# Altium schematic sheet Microcontroller.SchDoc
size 270 x 162 mm; SheetNumber: 1; SheetTotal: 1
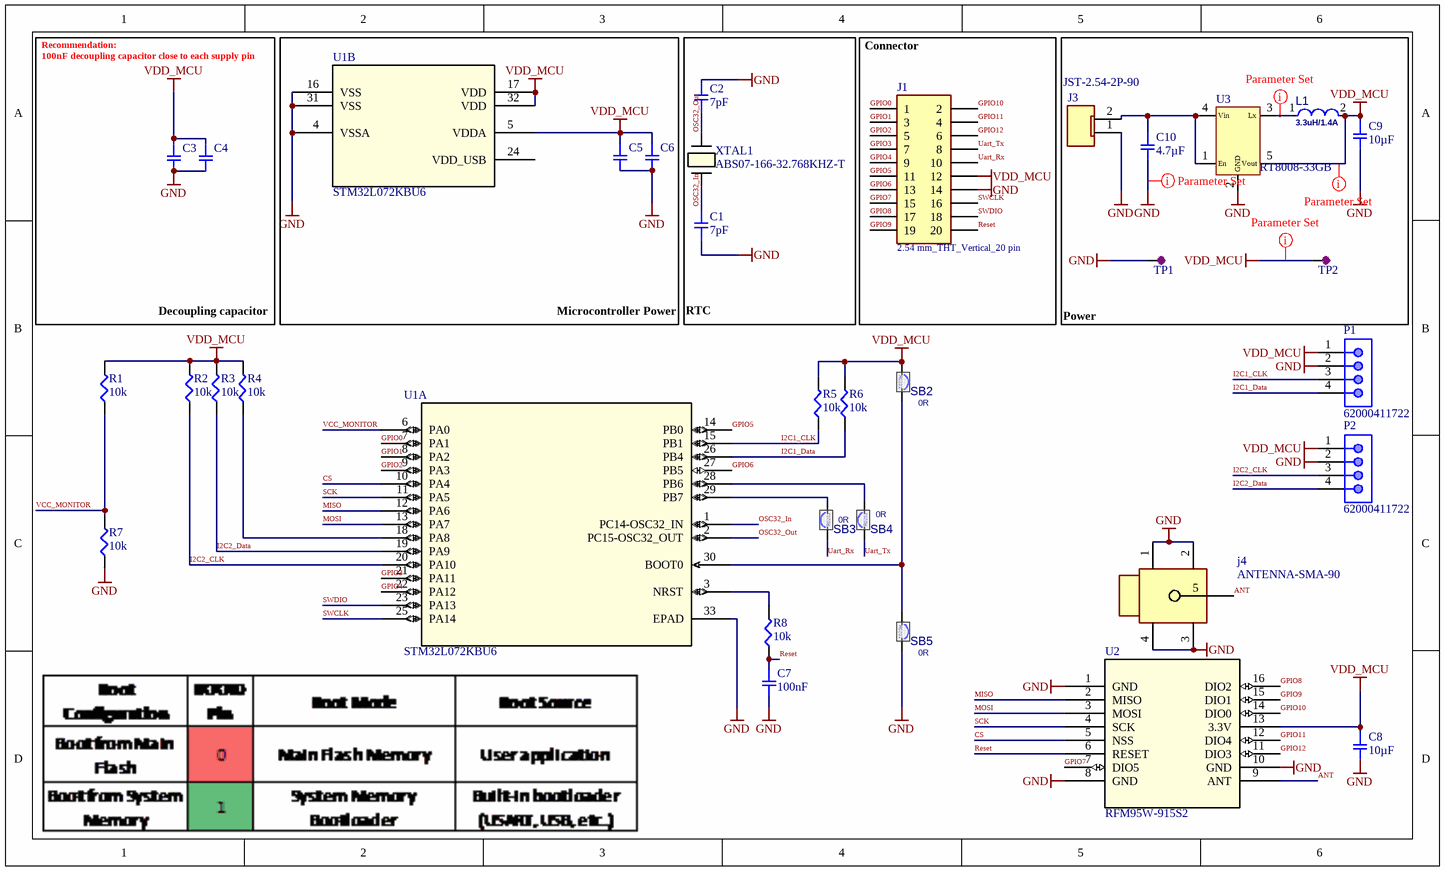
[diagram p0: Microcontroller.SchDoc]

## Parts
C1  7pF  [SMD-0402C]
C2  7pF  [SMD-0402C]
C3  100nF  [Cap0201]  (value not drawn)
C4  100nF  [Cap0201]  (value not drawn)
C5  100nF  [Cap0201]  (value not drawn)
C6  1µF  [Cap0201]  (value not drawn)
C7  100nF  [Cap0201]
C8  10µF  [SMD-0805C]
C9  10µF  [SMD-0805C]
C10  4.7µF  [SMD-0805C]
J1  2.54 mm_THT_Vertical_20 pin  [61302021121]
J3  JST-2.54-2P-90  [JST-2.54-2P-90]
j4  ANTENNA-SMA-90  [ANTENNA-SMA-90]
L1  3.3uH/1.4A  [INDP2520x12N]
P1  62000411722  [62000411722]
P2  62000411722  [62000411722]
R1  10k  [Res0201]
R2  10k  [Res0201]
R3  10k  [Res0201]
R4  10k  [Res0201]
R5  10k  [Res0201]
R6  10k  [Res0201]
R7  10k  [Res0201]
R8  10k  [Res0201]
SB2  0R  [Res0201]
SB3  0R  [Res0201]
SB4  0R  [Res0201]
SB5  0R  [Res0201]
TP1  TPSMD_25mil  [TPSMD_25mil]  (value not drawn)
TP2  TPSMD_25mil  [TPSMD_25mil]  (value not drawn)
U1  STM32L072KBU6  [UFQFPN32-5x5mm-L]  (parts A,B of 2)
U2  RFM95W-915S2  [IC16_RFM95W-915S2_RFS]
U3  RT8008-33GB  [SOT23, 5]
XTAL1  ABS07-166-32.768KHZ-T  [XTAL_ABS07-166-32.768KHZ-T_ABR]

## Blocks framed on the sheet
Decoupling capacitor: C3 C4
Microcontroller Power: C5 C6 U1
RTC: C1 C2 XTAL1
Connector: J1
Power: C9 C10 J3 L1 TP1 TP2 U3

## Nets
GND: C1.1 C2.2 C3.2 C4.2 C5.2 C6.2 C7.2 C8.2 C9.2 C10.2 J1.14 J3.1 j4.1 j4.2 j4.3 j4.4 P1.2 P2.2 R7.1 SB5.1 TP1.1 U1.4(VSSA) U1.16(VSS) U1.31(VSS) U1.33(EPAD) U2.1(GND) U2.8(GND) U2.10(GND) U3.2(GND)
VDD_MCU: C3.1 C4.1 C5.1 C6.1 C8.1 C9.1 J1.12 L1.2 P1.1 P2.1 R1.2 R2.2 R3.2 R4.2 R5.2 R6.2 SB2.2 TP2.1 U1.5(VDDA) U1.17(VDD) U1.32(VDD) U2.13(3.3V) U3.5(Vout)
ANT: j4.5 U2.9(ANT)
CS: U1.10(PA4) U2.5(NSS)
GPIO0: J1.1 U1.7(PA1)
GPIO1: J1.3 U1.8(PA2)
GPIO2: J1.5 U1.9(PA3)
GPIO3: J1.7 U1.21(PA11)
GPIO4: J1.9 U1.22(PA12)
GPIO5: J1.11 U1.14(PB0)
GPIO6: J1.13 U1.27(PB5)
GPIO7: J1.15 U2.7(DIO5)
GPIO8: J1.17 U2.16(DIO2)
GPIO9: J1.19 U2.15(DIO1)
GPIO10: J1.2 U2.14(DIO0)
GPIO11: J1.4 U2.12(DIO4)
GPIO12: J1.6 U2.11(DIO3)
I2C1_CLK: P1.3 R5.1 U1.15(PB1)
I2C1_Data: P1.4 R6.1 U1.26(PB4)
I2C2_CLK: P2.3 R2.1 U1.20(PA10)
I2C2_Data: P2.4 R3.1 U1.19(PA9)
MISO: U1.12(PA6) U2.2(MISO)
MOSI: U1.13(PA7) U2.3(MOSI)
OSC32_In: C1.2 U1.1(PC14-OSC32_IN) XTAL1.2
OSC32_Out: C2.1 U1.2(PC15-OSC32_OUT) XTAL1.1
Reset: C7.1 J1.20 R8.1 U2.6(RESET)
SCK: U1.11(PA5) U2.4(SCK)
SWCLK: J1.16 U1.25(PA14)
SWDIO: J1.18 U1.23(PA13)
Uart_Rx: J1.10 SB3.2
Uart_Tx: J1.8 SB4.2
VCC_MONITOR: R1.1 R7.2 U1.6(PA0)
NetC10_1: C10.1 J3.2 U3.1(En) U3.4(Vin)
NetL1_1: L1.1 U3.3(Lx)
NetR4_1: R4.1 U1.18(PA8)
NetR8_2: R8.2 U1.3(NRST)
NetSB2_1: SB2.1 SB5.2 U1.30(BOOT0)
NetSB3_1: SB3.1 U1.29(PB7)
NetSB4_1: SB4.1 U1.28(PB6)

Not connected (* = marked no-connect by the designer): U1 24(VDD_USB)

## Layout directives
rule Width Constraint [Pref Width = 0.3mm    Min Width = 0.254mm    Max Width = 0.4mm]: (no net found under the mark), GND, VDD_MCU

## Notes on the sheet
- Recommendation:
  100nF decoupling capacitor close to each supply pin
- (in symbol RC0201JR-070RL) R0201

## Library data of the parts
C1 C2 = GJM1555C1H7R0DB01D: CAP CER 7PF 50V NP0 0402; Manufacturer: Murata Electronics North America; Factory Stock: 0; Unit Price (USD): 0.12; Minimum Quantity: 1; Tolerance: ±0.5pF; Temperature Coefficient: C0G, NP0; Datasheets: http://www.murata.com/~/media/webrenewal/support/library/catalog/products/capacitor/mlcc/c02e.pdf; Image: //media.digikey.com/Renders/Murata%20Renders/ZRB-SERIES-0402.jpg; Digi-Key Part Number: 490-13315-1-ND; Part Number: GJM1555C1H7R0DB01D; Quantity Available: 9210; @ qty: 0; Packaging: Cut Tape (CT); Series: GJM; Part Status: Active; Value: 7pF; Voltage: 50V; Operating Temperature: -55°C ~ 125°C; Features: High Q, Low Loss; Ratings: -; Applications: RF, Microwave, High Frequency; Mounting Type: Surface Mount, MLCC; Package / Case: 0402 (1005 Metric); Size / Dimension: 0.039" L x 0.020" W (1.00mm x 0.50mm); Height - Seated (Max): -; Thickness (Max): 0.022" (0.55mm); Lead Spacing: -; Lead Style: -
C3-C5 C7 = GRM033R61A104ME15D: CAP CER 0.1UF 10V X5R 0201; Manufacturer: Murata Electronics North America; Factory Stock: 0; Unit Price (USD): 0.1; Minimum Quantity: 1; Tolerance: ±20%; Datasheets: http://www.murata.com/~/media/webrenewal/support/library/catalog/products/capacitor/mlcc/c02e.pdf; Image: //media.digikey.com/Renders/Murata%20Renders/ZRB-SERIES-0402.jpg; Digi-Key Part Number: 490-5405-1-ND; Part Number: GRM033R61A104ME15D; Quantity Available: 295564; @ qty: 0; Packaging: Cut Tape (CT); Series: GRM; Part Status: Active; Value: 100nF; Voltage: 10V; Temperature Coefficient: X5R; Operating Temperature: -55°C ~ 85°C; Features: -; Ratings: -; Applications: General Purpose; Failure Rate: Surface Mount, MLCC; Mounting Type: 0201 (0603 Metric); Package / Case: 0.024" L x 0.012" W (0.60mm x 0.30mm); Size / Dimension: -; Height - Seated (Max): 0.013" (0.33mm); Thickness (Max): -; Lead Spacing: -
C6 = GRM033R61A105ME15D: CAP CER 1UF 10V X5R 0201; Manufacturer: Murata Electronics North America; Factory Stock: 0; Unit Price (USD): 0.37; Minimum Quantity: 1; Tolerance: ±20%; Datasheets: http://www.murata.com/~/media/webrenewal/support/library/catalog/products/capacitor/mlcc/c02e.pdf; Image: //media.digikey.com/Renders/Murata%20Renders/ZRB-SERIES-0402.jpg; Digi-Key Part Number: 490-13226-1-ND; Part Number: GRM033R61A105ME15D; Quantity Available: 233419; @ qty: 0; Packaging: Cut Tape (CT); Series: GRM; Part Status: Active; Value: 1µF; Voltage: 10V; Temperature Coefficient: X5R; Operating Temperature: -55°C ~ 85°C; Features: -; Ratings: -; Applications: General Purpose; Failure Rate: Surface Mount, MLCC; Mounting Type: 0201 (0603 Metric); Package / Case: 0.024" L x 0.012" W (0.60mm x 0.30mm); Size / Dimension: -; Height - Seated (Max): 0.015" (0.39mm); Thickness (Max): -; Lead Spacing: -
C8 C9 = GRJ21BR71A106KE01L: CAP CER 10UF 10V X7R 0805; Manufacturer: Murata Electronics North America; Factory Stock: 0; Unit Price (USD): 0.69; Minimum Quantity: 1; Tolerance: ±10%; Datasheets: http://www.murata.com/~/media/webrenewal/support/library/catalog/products/capacitor/mlcc/c02e.pdf; Image: //media.digikey.com/Renders/Murata%20Renders/0805%20(2012%20Metric)%20.85mm.jpg; Digi-Key Part Number: 490-10919-1-ND; Part Number: GRJ21BR71A106KE01L; Quantity Available: 6658; @ qty: 0; Packaging: Cut Tape (CT); Series: GRJ; Part Status: Active; Value: 10µF; Voltage: 10V; Temperature Coefficient: X7R; Operating Temperature: -55°C ~ 125°C; Features: Soft Termination; Ratings: -; Applications: Boardflex Sensitive; Mounting Type: Surface Mount, MLCC; Package / Case: 0805 (2012 Metric); Size / Dimension: 0.079" L x 0.049" W (2.00mm x 1.25mm); Height - Seated (Max): -; Thickness (Max): 0.057" (1.45mm); Lead Spacing: -; Lead Style: -
C10 = GRM21BR60J475KA11L: CAP CER 4.7UF 6.3V X5R 0805; Manufacturer: Murata Electronics North America; Factory Stock: 0; Unit Price (USD): 0.28; Minimum Quantity: 1; Tolerance: ±10%; Datasheets: http://www.murata.com/~/media/webrenewal/support/library/catalog/products/capacitor/mlcc/c02e.pdf; Image: //media.digikey.com/Renders/Murata%20Renders/0805%20(2012%20Metric)%20.85mm.jpg; Digi-Key Part Number: 490-9749-1-ND; Part Number: GRM21BR60J475KA11L; Quantity Available: 2821; @ qty: 0; Packaging: Cut Tape (CT); Series: GRM; Part Status: Active; Value: 4.7µF; Voltage: 6.3V; Temperature Coefficient: X5R; Operating Temperature: -55°C ~ 85°C; Features: -; Ratings: -; Applications: General Purpose; Mounting Type: Surface Mount, MLCC; Package / Case: 0805 (2012 Metric); Size / Dimension: 0.079" L x 0.049" W (2.00mm x 1.25mm); Height - Seated (Max): -; Thickness (Max): 0.055" (1.40mm); Lead Spacing: -; Lead Style: -
J1 = 61302021121: Pin Header WR-PHD, pitch 2.54 mm, THT, Vertical, dual row, 20 pin; Rated Current: 3 A; Pin Number: 20; Pitch: 2.54 mm; Working Voltage: 250 VAC; Contact Resistance: 20 mOhm; Insulation Resistance: >1000 MOhm; ComponentLink1Description: Manufacturer; ComponentLink1URL: http://www.we-online.de; ComponentLink2Description: Datasheet; ComponentLink2URL: http://katalog.we-online.de/em/datasheet/6130xx21121.pdf; Part Number: 61302021121; Published Date: Jan. 2018; Publisher: Wurth Elektronik; Operating Temperature: -40 to 105 degC; Mounting Technology: THT; Row Number: Dual; Orientation: Vertical
J3 = JST-2.54-2P-90: Female Connector JST 2 Vias, 2.54mm 90º.
j4 = ANTENNA-SMA-90: Connector SMA for Antenna, 90º.; JLCPCB PN: C914554
L1 = ASPI-2515-3R3M-T2: Inductor_3.3uH 20%_1.3A_SMD 25*20; MANF: Abracon LLC; PARAM: Inductor 6.8uH 20% SMT 1.3A; PARAM2: 138mOhm DCR, –25 to +120°C; MANF_P#: ASPI-2515-3R3M-T2; PRICE: $0.28@100; VALUE: 3.3uH/1.4A
P1 P2 = 62000411722: WR-WTB THT Male Horizontal Shrouded Header, pitch 2mm, 4p; Pin Number: 4; Contact Resistance: 20mOhm; Rated Current: 2A; Withstanding Voltage: 800VAC; Working Voltage: 125VAC; ComponentLink1Description: Manufacturer; ComponentLink1URL: http://www.we-online.de; ComponentLink2Description: Datasheet; ComponentLink2URL: https://www.we-online.com/catalog/datasheet/62000411722.pdf; Pitch: 2mm; Published Date: January 2020; Publisher: Wurth Elektronik; Mounting Technology: THT; Packaging: Bag; Operating Temperature: -25 to +85degC; Part Number: 62000411722; Gender: Male; Type: Horizontal; VALUE: 62000411722
R1-R8 = ERJ-1GEF1002C: RES SMD 10K OHM 1% 1/20W 0201; Manufacturer: Panasonic Electronic Components; Factory Stock: 0; Unit Price (USD): 0.00933; @ qty: 1500; Minimum Quantity: 1; Power (Watts): 0.05W, 1/20W; Temperature Coefficient: ±200ppm/°C; Part Number: ERJ-1GEF1002C; Datasheets: //media.digikey.com/pdf/Data%20Sheets/Panasonic%20Resistors%20Thermistors%20PDFs/ERJ_G,R,E_Rev08.pdf; Image: //media.digikey.com/Renders/Panasonic%20Renders/ERJ-0201%20Pkg.jpg; Digi-Key Part Number: P10.0KABCT-ND; Quantity Available: 2802306; Packaging: Cut Tape (CT); Series: ERJ; Part Status: Active; Value: 10k; Tolerance: ±1%; Composition: Thick Film; Features: -; Operating Temperature: -55°C ~ 125°C; Package / Case: 0201 (0603 Metric); Supplier Device Package: 0201; Size / Dimension: 0.024" L x 0.012" W (0.60mm x 0.30mm); Height - Seated (Max): 0.010" (0.26mm); Number of Terminations: 2; Failure Rate: -
SB2-SB5 = RC0201JR-070RL: RES_0 Ohm_ Jumper_1/16W_SMD 0402; MANF_P#: RC0402JR-070RL; MANF: Yageo; PARAM: 1/16W; PARAM2: -55°C ~ 155°C; ASSEMBLY: ASSEMBLY; PRICE: $0.03717@100; VALUE: 0R
U1 = STM32L072KBU6: No Description Available; Mfr_Name: STMicroelectronics; RefDes: RefDes; Type: Type
U2 = RFM95W-915S2: Description; Manufacturer_Name: RF Solutions; Copyright: Copyright (C) 2025 Ultra Librarian. All rights reserved.; Manufacturer_Part_Number: RFM95W-915S2; RefDes: RefDes; Type: Type
XTAL1 = ABS07-166-32.768KHZ-T: Description; Manufacturer_Name: Abracon; Copyright: Copyright (C) 2025 Ultra Librarian. All rights reserved.; Manufacturer_Part_Number: ABS07-166-32.768KHZ-T